# Altium project Beacon.PrjPCB
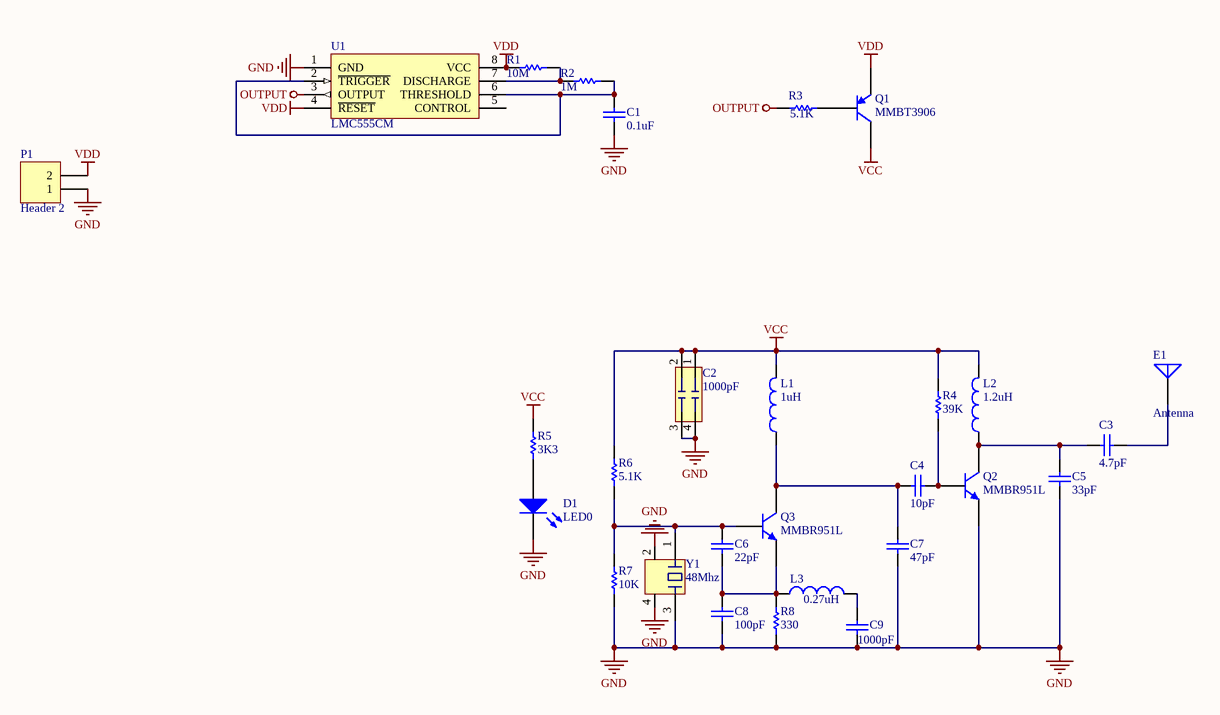
[diagram p0: Beacon.SchDoc]
1 sheet, 28 parts. Net scope: global (net labels, ports and power ports of the same name join across sheets).
Board files: Beacon.PcbDoc, Beacon_Vcut.PcbDoc

## Sheet Beacon.SchDoc
size A4

### Parts
C1  0.1uF  [0603]
C2  1000pF  [CKCL22]
C3  4.7pF  [0402]
C4  10pF  [0402]
C5  33pF  [0402]
C6  22pF  [0402]
C7  47pF  [0402]
C8  100pF  [0402]
C9  1000pF  [0402]
D1  LED0  [0402]
E1  Antenna  [PIN1]
L1  1uH  [1008]
L2  1.2uH  [1008]
L3  0.27uH  [0402]
P1  Header 2  [HDR1X2]
Q1  MMBT3906  [sot-923f]
Q2  MMBR951L  [sot-23]
Q3  MMBR951L  [sot-23]
R1  10M  [0402]
R2  1M  [0603]
R3  5.1K  [0402]
R4  39K  [0402]
R5  3K3  [0402]
R6  5.1K  [0402]
R7  10K  [0402]
R8  330  [0402]
U1  LMC555CM  [vssop8]
Y1  48Mhz  [Xtal 3.2x2.5]

### Nets
GND: C1.1 C2.3 C2.4 C5.1 C7.1 C8.1 C9.2 D1.2(K) P1.1 Q2.3(E) R7.1 R8.1 U1.1(GND) Y1.2 Y1.3 Y1.4
OUTPUT: R3.1 U1.3(OUTPUT)
VCC: C2.1 C2.2 L1.2 L2.2 Q1.3(C) R4.2 R5.2 R6.2
VDD: P1.2 Q1.2(E) R1.2 U1.4(~{RESET}) U1.8(VCC)
NetC1_2: C1.2 R2.1 U1.2(~{TRIGGER}) U1.6(THRESHOLD)
NetC3_1: C3.1 E1.1(A)
NetC3_2: C3.2 C5.2 L2.1 Q2.1(C)
NetC4_1: C4.1 Q2.2(B) R4.1
NetC4_2: C4.2 C7.2 L1.1 Q3.1(C)
NetC6_1: C6.1 C8.2 L3.1 Q3.3(E) R8.2
NetC6_2: C6.2 Q3.2(B) R6.1 R7.2 Y1.1
NetC9_1: C9.1 L3.2
NetD1_1: D1.1(A) R5.1
NetQ1_1: Q1.1(B) R3.2
NetR1_1: R1.1 R2.2 U1.7(DISCHARGE)

Not connected (* = marked no-connect by the designer): U1 5(CONTROL)

### Library data of the parts
C1 C3-C9 = Cap: Capacitor; Published: 8-Jun-2000; LatestRevisionDate: 17-Jul-2002; LatestRevisionNote: Re-released for DXP Platform.; PackageReference: RAD-0.3; Publisher: Altium Limited
  C1: Value: 0.1uF
  C3: Value: 4.7pF
  C4: Value: 10pF
  C5: Value: 33pF
  C6: Value: 22pF
  C7: Value: 47pF
  C8: Value: 100pF
  C9: Value: 1000pF
C2 = CAP ARRAY 2: Value: 1000pF
D1 = LED0: Typical INFRARED GaAs LED; Published: 8-Jun-2000; LatestRevisionDate: 08-Jul-2005; LatestRevisionNote: Mech Layer 1 removed.; PackageReference: LED-0; Publisher: Altium Limited; PackageDescription: LED; 2 Leads
E1 = Antenna: Generic Antenna; Published: 24-Mar-1999; LatestRevisionDate: 17-Jul-2002; LatestRevisionNote: Re-released for DXP Platform.; PackageReference: PIN1; Publisher: Altium Limited
L1-L3 = Inductor: Code_IEC: 1005; Published: 8-Jun-2000; LatestRevisionDate: 29-May-2009; LatestRevisionNote: IPC-7351 Footprint Added.; PackageReference: 0402-A; Publisher: Altium Limited; PackageDescription: Chip Inductor; Code_JEITA: 0402
  L1: Value: 1uH
  L2: Value: 1.2uH
  L3: Value: 0.27uH
P1 = Header 2: Header, 2-Pin; LatestRevisionDate: 17-Jul-2002; LatestRevisionNote: Re-released for DXP Platform.; Publisher: Altium Limited
Q1 = MMBT3906: PNP Switching Transistor; Published: 17-Sep-2003; LatestRevisionDate: 12-Dec-2006; LatestRevisionNote: IPC-7351 Footprint Added.; DatasheetVersion: 11-Apr-2000; PackageVersion: May-1999; PackageReference: SOT23; Publisher: Altium Limited; PackageDescription: 3-Pin SOT-23 Package 0.95 mm Pitch, 2.3 mm Lead Span; ComponentLink1Description: Manufacturer Link; ComponentLink1URL: http://www.semiconductors.philips.com/; ComponentLink2Description: Datasheet; ComponentLink2URL: http://www.semiconductors.philips.com/acrobat/datasheets/MMBT3906_2.pdf
Q2 Q3 = NPN: NPN Bipolar Transistor; Published: 8-Jun-2000; LatestRevisionDate: 17-Jul-2002; LatestRevisionNote: Re-released for DXP Platform.; PackageReference: TO-226; Publisher: Altium Limited; Code_JEDEC: TO-226-AA
R1-R8 = Res1: Resistor; Published: 8-Jun-2000; LatestRevisionDate: 17-Jul-2002; LatestRevisionNote: Re-released for DXP Platform.; PackageReference: AXIAL-0.3; Publisher: Altium Limited
  R1: Value: 10M
  R2: Value: 1M
  R3 R6: Value: 5.1K
  R4: Value: 39K
  R5: Value: 3K3
  R7: Value: 10K
  R8: Value: 330
Y1 = Xtal 4pin